# Altium schematic sheet LM386.SchDoc
size A4
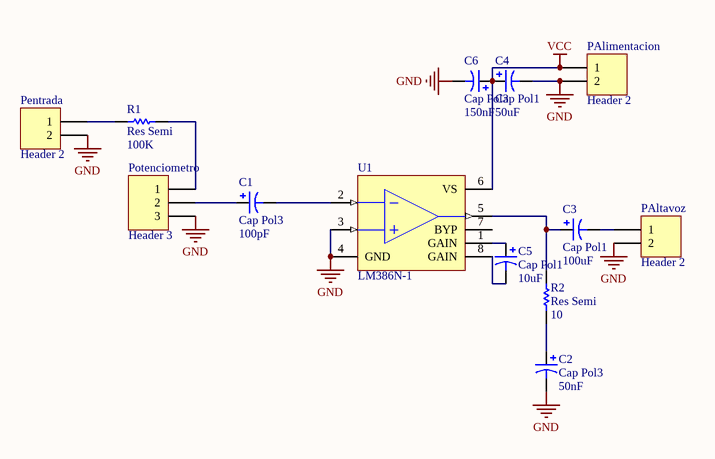
[diagram p0: LM386.SchDoc]

## Parts
C1  Cap Pol3  value 100pF  [C0805]
C2  Cap Pol3  value 50nF  [C0805]
C3  Cap Pol1  value 100uF  [HA-C1]
C4  Cap Pol1  value 50uF  [HA-C1]
C5  Cap Pol1  value 10uF  [HA-C1]
C6  Cap Pol3  value 150nF  [C0805]
PAlimentacion  Header 2  [HDR1X2]
PAltavoz  Header 2  [HDR1X2]
Pentrada  Header 2  [HDR1X2]
Potenciometro  Header 3  [HDR1X3]
R1  Res Semi  value 100K  [2012[0805]]
R2  Res Semi  value 10  [2012[0805]]
U1  LM386N-1  [N08E]

## Nets
GND: C2.2 C4.2 C6.2 PAlimentacion.2 PAltavoz.2 Pentrada.2 Potenciometro.3 U1.3(IN+) U1.4(GND)
VCC: C4.1 C6.1 PAlimentacion.1 U1.6(VS)
NetC1_1: C1.1 Potenciometro.2
NetC1_2: C1.2 U1.2(IN-)
NetC2_1: C2.1 R2.1
NetC3_1: C3.1 R2.2 U1.5(OUT)
NetC3_2: C3.2 PAltavoz.1
NetC5_1: C5.1 U1.1(GAIN)
NetC5_2: C5.2 U1.8(GAIN)
NetPentrada_1: Pentrada.1 R1.1
NetPotenciometro_1: Potenciometro.1 R1.2

Not connected (* = marked no-connect by the designer): U1 7(BYP)

## Library data of the parts
C1 C2 C6 = Cap Pol3: Polarized Capacitor (Surface Mount); Published: 8-Jun-2000; LatestRevisionDate: 17-Jul-2002; LatestRevisionNote: Re-released for DXP Platform.; PackageReference: C0805; Publisher: Altium Limited
C3-C5 = Cap Pol1: Polarized Capacitor (Radial); Published: 8-Jun-2000; LatestRevisionDate: 17-Jul-2002; LatestRevisionNote: Re-released for DXP Platform.; PackageReference: RB7.6-15; Publisher: Altium Limited
PAlimentacion PAltavoz Pentrada = Header 2: Header, 2-Pin; LatestRevisionDate: 17-Jul-2002; LatestRevisionNote: Re-released for DXP Platform.; Publisher: Altium Limited
Potenciometro = Header 3: Header, 3-Pin; LatestRevisionDate: 17-Jul-2002; LatestRevisionNote: Re-released for DXP Platform.; Publisher: Altium Limited
R1 R2 = Res Semi: Semiconductor Resistor; Published: 8-Jun-2000; LatestRevisionDate: 17-Jul-2002; LatestRevisionNote: Re-released for DXP Platform.; PackageReference: AXIAL-0.5; Publisher: Altium Limited
U1 = LM386N-1: Low-Voltage Audio Power Amplifier; Published: 15-Apr-2002; LatestRevisionDate: 06-Jun-2005; LatestRevisionNote: Stylized 3D Model Added.; DatasheetDocument: Sep-1997; PackageDocument: Sep-1997; PackageReference: N08E; Publisher: Altium Limited; ComponentLink1Description: Manufacturer Link; ComponentLink1URL: http://www.national.com/; ComponentLink2Description: Datasheet; ComponentLink2URL: http://www.national.com/ds.cgi/LM/LM386.pdf; ComponentLink3Description: URL Link1; ComponentLink3URL: http://www.national.com/pf/LM/LM386.html